# Altium schematic sheet EXTERNAL_FAN.SchDoc
size 420 x 297 mm; SheetNumber: 8; SheetTotal: 20
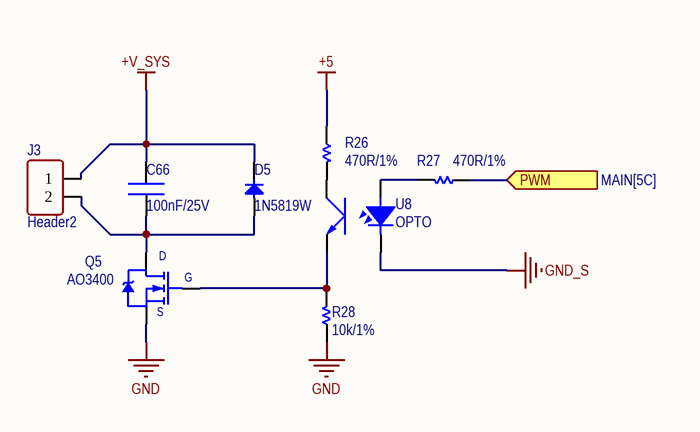
[diagram p0: EXTERNAL_FAN.SchDoc]

## Parts
C66  100nF/25V  [CN-SMD-0603]
D5  1N5819W  [DIO-SMD-123]
J3  Header2  [XH2.54-2-DIP]
Q5  AO3400  [SOT23-123]
R26  470R/1%  [RES-SMD-0603]
R27  470R/1%  [RES-SMD-0603]
R28  10k/1%  [RES-SMD-0603]
U8  OPTO  [EL3H7]

## Ports
PWM (in, see MAIN[5C])

## Nets
+5: R26.1
+V_SYS: C66.1 D5.2(K) J3.1
GND: Q5.3(S) R28.1
GND_S: U8.K
PWM: R27.1 ; port PWM
NetC66_2: C66.2 D5.1(A) J3.2 Q5.2(D)
NetQ5_1: Q5.1(G) R28.2 U8.E
NetR26_2: R26.2 U8.C
NetR27_2: R27.2 U8.A

## Notes on the sheet
- Project:
- Sub-system:
- Design by:
- Sheet title:
- Sheet
- of
- Checked by:
- Approved by:
- Document No:
- Revision:
- Size:
- Date:

## Library data of the parts
C66 = CN: CAP CER 0.1UF 25V X7R 0603; PN: CL10B104KA8NNNC
D5 = Diode SMD: DIODE SCHOTTKY 40V 1A SOD123FL; Code - JEDEC: DO-214-AB; Published: 8-Jun-2000; Revision: July-2002: Re-released for DXP Platform.; Publisher: Altium Limited; PN: 1N5819W
J3 = Header2: Connector 2; Manufacturer: W¨¹rth Elektronik eiSos GmbH; partNo: 613002143121; ComponentLink1 Description: Manufacturer; ComponentLink2 Description: Datasheet; NoPins: 02; Created Date: 29 March 2013; ComponentLink1URL: http://www.we-online.com; ComponentLink2URL: http://katalog.we-online.de/em/datasheet/6130xx143121.pdf; Created by: Karrer Zheng
Q5 = AO3400: MOSFET N-CH 30V 5.7A SOT23-3L; PN: AO3400; Parameter 1: *
R26 R27 = Res-SMD: RES 470 OHM 1% 1/10W 0603; Manufacturer: Generic Components; PN: RC0603FR-07470RL; Class: Passive; Publisher: Altium Hobart Technology Centre
R28 = Res-SMD: RES SMD 10K OHM 1% 1/10W 0603; Manufacturer: Generic Components; PN: ERJ-3EKF1002V; Class: Passive; Publisher: Altium Hobart Technology Centre
U8 = OPTO: OPTOISO 3.75KV 1CH TRANS 4-SSOP; PN: EL3H7(B)(TA)-VG